# Altium schematic sheet HU_revB.SchDoc
size C; SheetNumber: 1; SheetTotal: 17
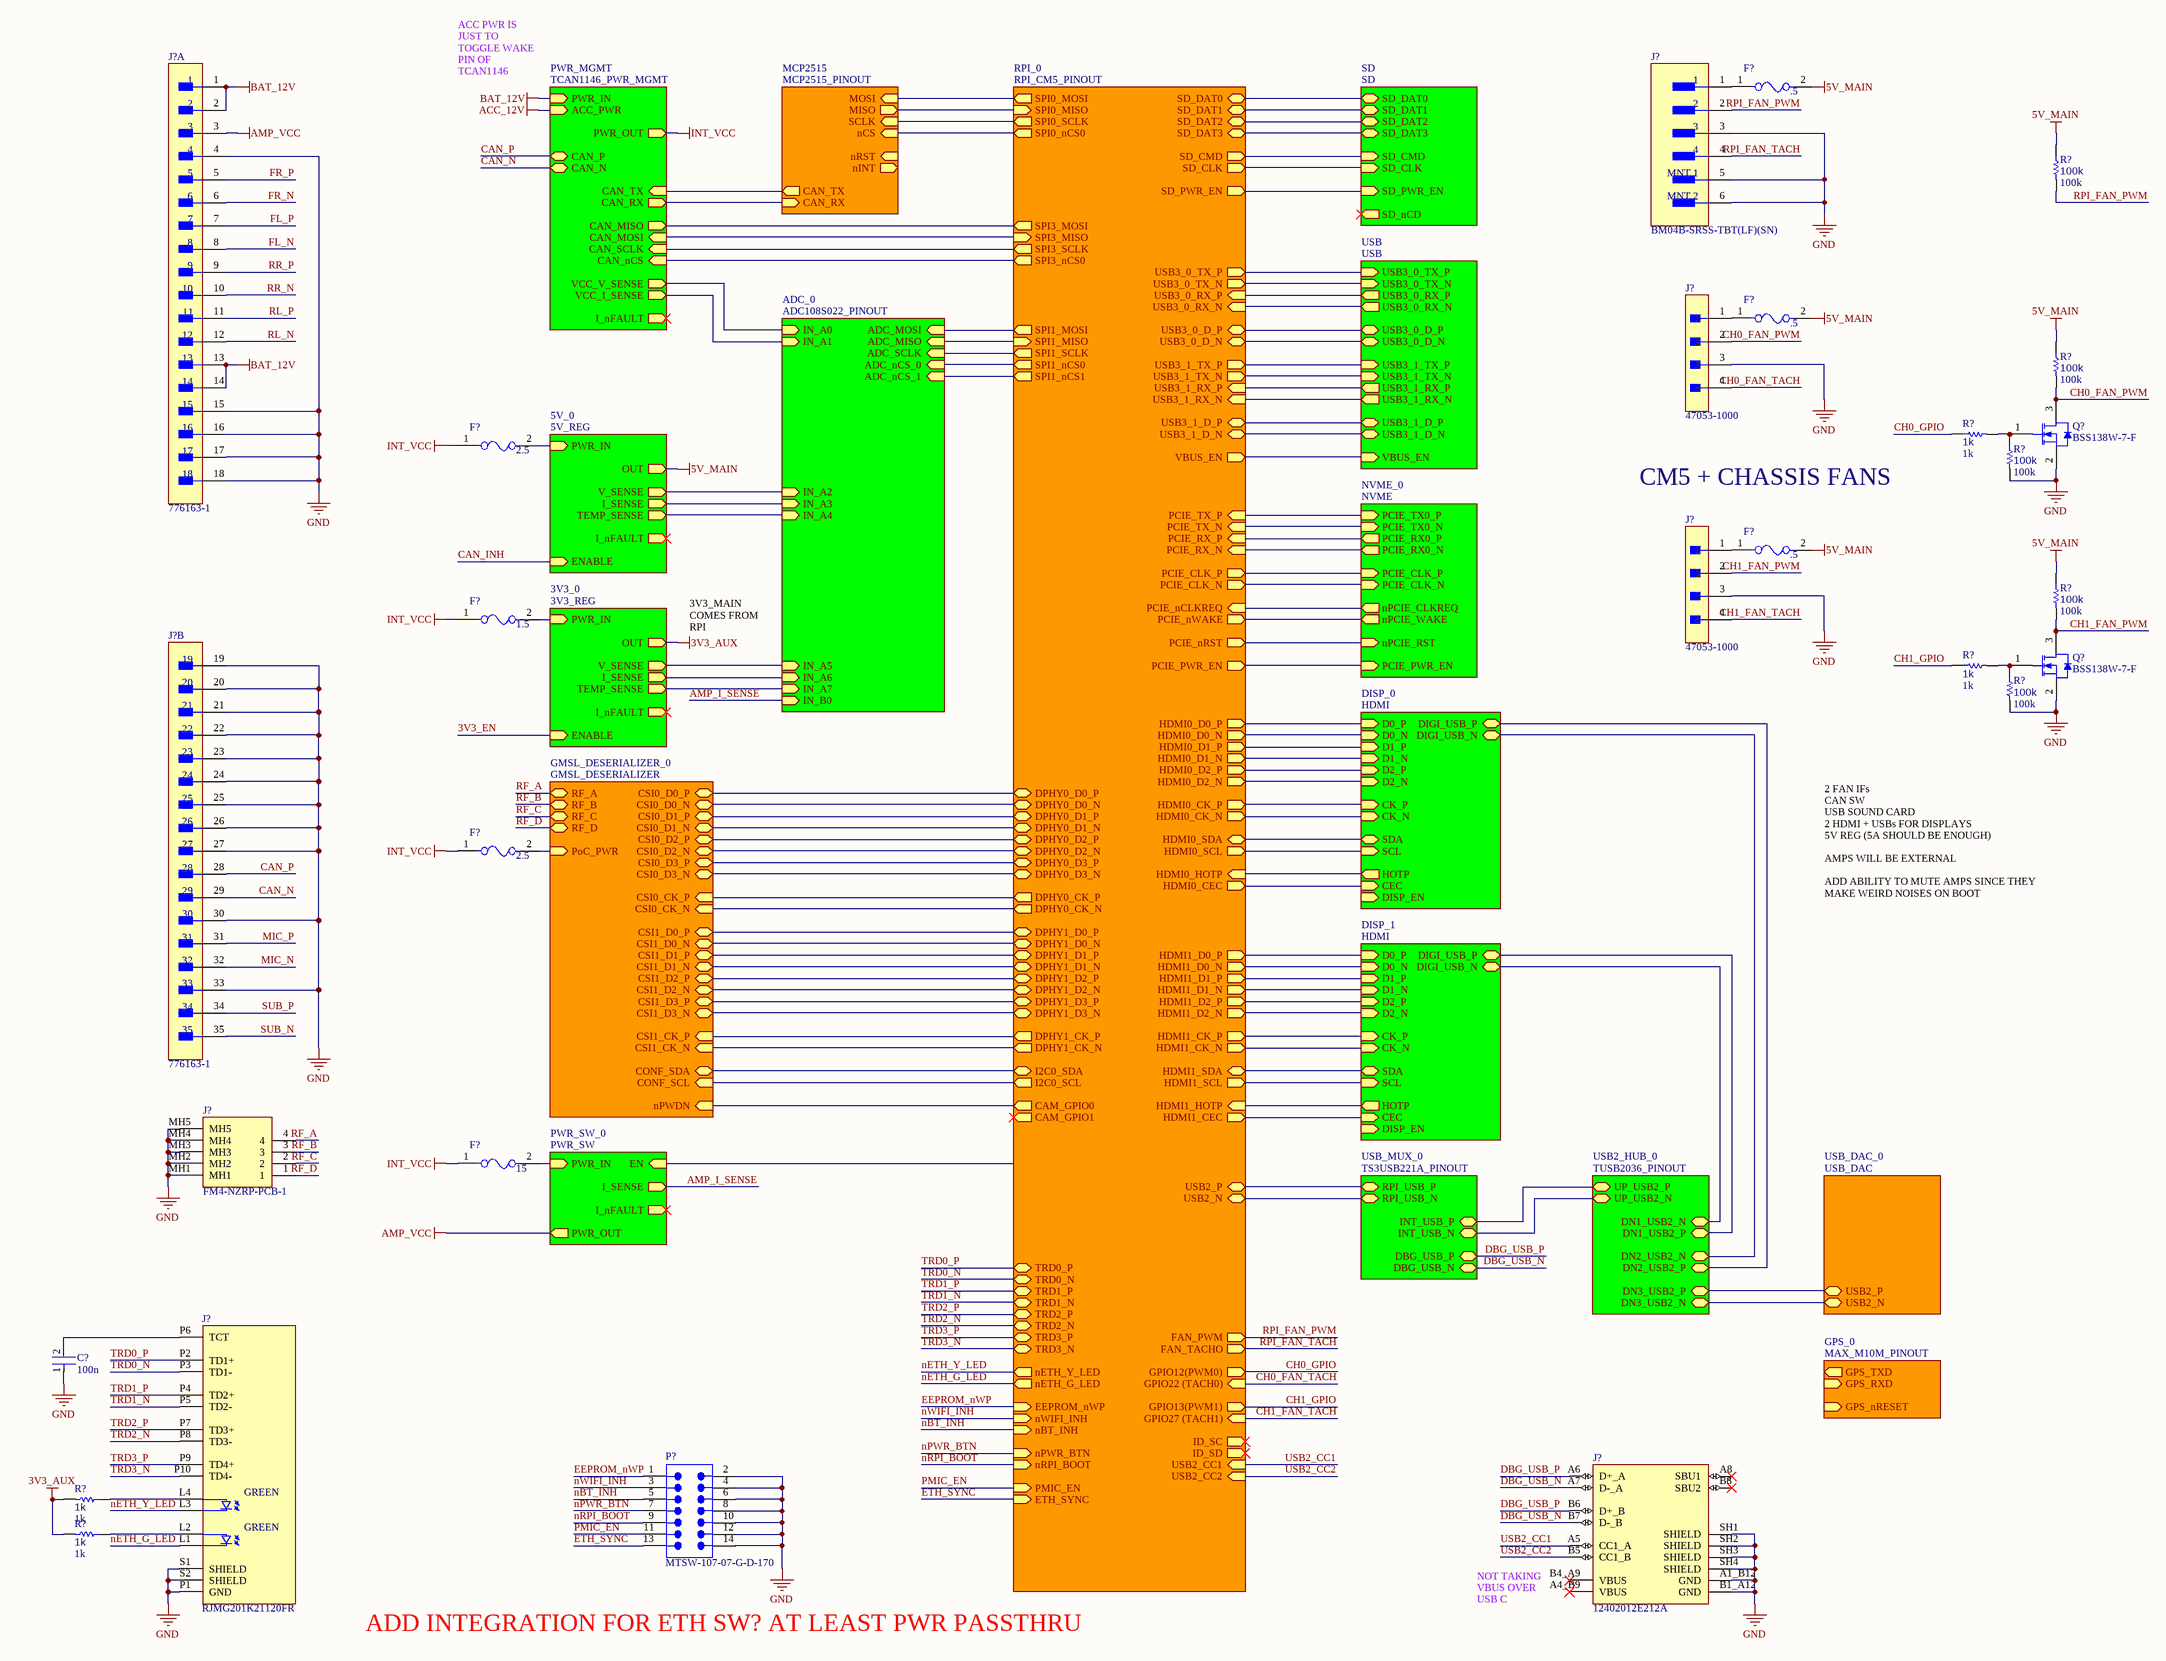
[diagram p0: HU_revB.SchDoc]

## Parts
(Parts that share a designator on the sheet are numbered #1, #2 ... from top to bottom, then left to right.)
C?  100n  [FP-0402-L_1_0_0_05-W_0_5-IPC_A]
F?#1  .5  [FP-0685T-MFG]
F?#2  .5  [FP-0685T-MFG]
F?#3  2.5  [FP-0685T-MFG]
F?#4  .5  [FP-0685T-MFG]
F?#5  1.5  [FP-0685T-MFG]
F?#6  2.5  [FP-0685T-MFG]
F?#7  15  [FP-0685T-MFG]
J?#1  776163-1  [FP-776163-1-MFG]  (part A of 2)
J?#2  BM04B-SRSS-TBT(LF)(SN)  [FP-BM04B-SRSS-TBT_LF_SN-MFG]
J?#3  47053-1000  [FP-470531000-MFG]
J?#4  47053-1000  [FP-470531000-MFG]
J?#5  776163-1  [FP-776163-1-MFG]  (part B of 2)
J?#6  FM4-NZRP-PCB-1  [FM4-NZRP-PCB-1-Footprint-1]
J?#7  RJMG201K21120FR  [RJMG201K21120FR-Footprint-1]
J?#8  12402012E212A  [12402012E212A-Footprint-1]
P?  MTSW-107-07-G-D-170  [SMTC-MTSW-107-07-X-D-170]
Q?#1  BSS138W-7-F  [DIOD-SOT323-3_V]
Q?#2  BSS138W-7-F  [DIOD-SOT323-3_V]
R?#1  100k  [R0603B]
R?#2  100k  [R0603B]
R?#3  1k  [R0603B]
R?#4  100k  [R0603B]
R?#5  100k  [R0603B]
R?#6  1k  [R0603B]
R?#7  100k  [R0603B]
R?#8  1k  [R0603B]
R?#9  1k  [R0603B]

## Sub-sheets
3V3_0 = 3V3_REG: PWR_IN (in), OUT (out), V_SENSE (out), I_SENSE (out), TEMP_SENSE (out), I_nFAULT (out), ENABLE (in)
5V_0 = 5V_REG: PWR_IN (in), OUT (out), V_SENSE (out), I_SENSE (out), TEMP_SENSE (out), I_nFAULT (out), ENABLE (in)
ADC_0 = ADC108S022_PINOUT: IN_A0 (in), IN_A1 (in), IN_A2 (in), IN_A3 (in), IN_A4 (in), IN_A5 (in), IN_A6 (in), IN_A7 (in), IN_B0 (in), ADC_MOSI (in), ADC_MISO (in), ADC_SCLK (in), ADC_nCS_0 (in), ADC_nCS_1 (in)
DISP_0 = HDMI: D0_N (in), D0_P (in), D2_P (in), D2_N (in), D1_P (in), D1_N (in), CK_P (in), CK_N (in), CEC (in), HOTP (out), SCL (in), SDA (bidir), DISP_EN (in), DIGI_USB_P (bidir), DIGI_USB_N (bidir)
DISP_1 = HDMI: D0_N (in), D0_P (in), D2_P (in), D2_N (in), D1_P (in), D1_N (in), CK_P (in), CK_N (in), CEC (in), HOTP (out), SCL (in), SDA (bidir), DISP_EN (in), DIGI_USB_P (bidir), DIGI_USB_N (bidir)
GMSL_DESERIALIZER_0 = GMSL_DESERIALIZER: CSI0_D0_P (bidir), CSI0_D0_N (bidir), CSI0_D1_P (bidir), CSI0_D1_N (bidir), CSI0_D2_P (bidir), CSI0_D2_N (bidir), CSI0_D3_P (bidir), CSI0_D3_N (bidir), CSI0_CK_P (in), CSI0_CK_N (in), CSI1_D0_P (bidir), CSI1_D0_N (bidir), CSI1_D1_P (bidir), CSI1_D1_N (bidir), CSI1_D2_P (bidir), CSI1_D2_N (bidir), CSI1_D3_P (bidir), CSI1_D3_N (bidir), CSI1_CK_P (in), CSI1_CK_N (in), RF_B (bidir), RF_A (bidir), RF_C (bidir), RF_D (bidir), CONF_SDA (bidir), CONF_SCL (in), nPWDN (in), PoC_PWR (in)
GPS_0 = MAX_M10M_PINOUT: GPS_TXD (out), GPS_RXD (in), GPS_nRESET (in)
MCP2515 = MCP2515_PINOUT: MOSI (in), nCS (in), SCLK (in), MISO (out), nINT (out), nRST (in), CAN_RX (in), CAN_TX (out)
NVME_0 = NVME: nPCIE_RST (in), nPCIE_CLKREQ (out), nPCIE_WAKE (out), PCIE_PWR_EN (in), PCIE_TX0_N (in), PCIE_TX0_P (in), PCIE_RX0_N (out), PCIE_RX0_P (out), PCIE_CLK_N (in), PCIE_CLK_P (in)
PWR_MGMT = TCAN1146_PWR_MGMT: PWR_IN (in), PWR_OUT (out), CAN_P (bidir), CAN_N (bidir), CAN_TX (in), CAN_RX (out), CAN_SCLK (in), CAN_MISO (out), CAN_MOSI (in), CAN_nCS (in), VCC_V_SENSE (out), VCC_I_SENSE (out), I_nFAULT (out), ACC_PWR (in)
PWR_SW_0 = PWR_SW: PWR_IN (in), PWR_OUT (out), EN (in), I_SENSE (out), I_nFAULT (out)
RPI_0 = RPI_CM5_PINOUT: SD_CLK (out), SD_CMD (out), SD_DAT3 (bidir), SD_DAT0 (bidir), SD_DAT1 (bidir), SD_DAT2 (bidir), SD_PWR_EN (out), USB3_0_D_P (bidir), USB3_0_D_N (bidir), USB3_1_D_P (bidir), USB3_1_D_N (bidir), USB3_0_RX_N (in), USB3_0_RX_P (in), USB3_0_TX_N (out), USB3_0_TX_P (out), USB3_1_RX_N (in), USB3_1_RX_P (in), USB3_1_TX_N (out), USB3_1_TX_P (out), VBUS_EN (out), PCIE_nCLKREQ (in), PCIE_nWAKE (out), PCIE_PWR_EN (out), PCIE_CLK_P (out), PCIE_nRST (out), PCIE_CLK_N (out), PCIE_RX_P (in), PCIE_RX_N (in), PCIE_TX_P (in), PCIE_TX_N (in), HDMI1_HOTP (in), HDMI1_SDA (bidir), HDMI1_D2_P (out), HDMI1_D2_N (out), HDMI1_SCL (out), HDMI1_CEC (out), HDMI0_CEC (out), HDMI1_D1_P (out), HDMI1_D1_N (out), HDMI0_HOTP (in), HDMI1_D0_P (out), HDMI1_D0_N (out), HDMI1_CK_P (out), HDMI1_CK_N (out), HDMI0_D2_P (out), HDMI0_D2_N (out), HDMI0_D1_P (out), HDMI0_D1_N (out), HDMI0_D0_P (out), HDMI0_D0_N (out), HDMI0_CK_P (out), HDMI0_CK_N (out), HDMI0_SCL (out), HDMI0_SDA (bidir), USB2_N (bidir), USB2_P (bidir), DPHY0_D0_N (bidir), DPHY0_D0_P (bidir), DPHY0_D1_N (bidir), DPHY0_D1_P (bidir), DPHY0_D2_N (bidir), DPHY0_D2_P (bidir), DPHY0_D3_N (bidir), DPHY0_D3_P (bidir), DPHY0_CK_N (out), DPHY0_CK_P (out), DPHY1_D0_N (bidir), DPHY1_D0_P (bidir), DPHY1_D1_N (bidir), DPHY1_D1_P (bidir), DPHY1_D3_N (bidir), DPHY1_D2_N (bidir), DPHY1_D3_P (bidir), DPHY1_D2_P (bidir), DPHY1_CK_N (out), DPHY1_CK_P (out), TRD3_P (bidir), TRD1_P (bidir), TRD3_N (bidir), TRD1_N (bidir), TRD2_N (bidir), TRD0_N (bidir), TRD2_P (bidir), TRD0_P (bidir), nETH_Y_LED (out), nETH_G_LED (out), FAN_TACHO (out), FAN_PWM (out), SPI0_SCLK (out), SPI0_MISO (in), SPI0_nCS0 (out), SPI0_MOSI (out), SPI3_MOSI (out), SPI3_MISO (in), SPI3_SCLK (out), SPI3_nCS0 (out), SPI1_MISO (in), SPI1_MOSI (out), SPI1_nCS0 (out), SPI1_nCS1 (out), SPI1_SCLK (out), I2C0_SCL (out), I2C0_SDA (bidir), CAM_GPIO0 (out), CAM_GPIO1 (out), ETH_SYNC (in), EEPROM_nWP (in), nWIFI_INH (in), nBT_INH (in), nPWR_BTN (in), nRPI_BOOT (in), PMIC_EN (in), GPIO12(PWM0) (out), GPIO13(PWM1) (out), GPIO22 (TACH0) (in), GPIO27 (TACH1) (in), ID_SC (out), ID_SD (out), USB2_CC1 (in), USB2_CC2 (in)
SD = SD: SD_DAT0 (bidir), SD_DAT1 (bidir), SD_DAT2 (bidir), SD_DAT3 (bidir), SD_CMD (in), SD_CLK (in), SD_PWR_EN (in), SD_nCD (out)
USB = USB: USB3_0_D_P (bidir), USB3_0_D_N (bidir), USB3_1_D_P (bidir), USB3_1_D_N (bidir), VBUS_EN (in), USB3_0_TX_N (in), USB3_0_TX_P (in), USB3_0_RX_N (out), USB3_0_RX_P (out), USB3_1_TX_N (in), USB3_1_TX_P (in), USB3_1_RX_N (out), USB3_1_RX_P (out)
USB2_HUB_0 = TUSB2036_PINOUT: UP_USB2_N (bidir), UP_USB2_P (bidir), DN1_USB2_N (bidir), DN1_USB2_P (bidir), DN2_USB2_N (bidir), DN2_USB2_P (bidir), DN3_USB2_N (bidir), DN3_USB2_P (bidir)
USB_DAC_0 = USB_DAC: USB2_P (bidir), USB2_N (bidir)
USB_MUX_0 = TS3USB221A_PINOUT: RPI_USB_P (bidir), RPI_USB_N (bidir), DBG_USB_P (bidir), DBG_USB_N (bidir), INT_USB_P (bidir), INT_USB_N (bidir)

## Nets
3V3_AUX: R?#8.2 R?#9.2 ; sheet 3V3_0/OUT
5V_MAIN: F?#1.2 F?#2.2 F?#4.2 R?#1.1 R?#2.1 R?#5.1 ; sheet 5V_0/OUT
ACC_12V: sheet PWR_MGMT/ACC_PWR
AMP_VCC: J?#1.3 ; sheet PWR_SW_0/PWR_OUT
BAT_12V: J?#1.1 J?#1.2 J?#1.13 J?#1.14 ; sheet PWR_MGMT/PWR_IN
GND: C?.1 J?#1.4 J?#1.15 J?#1.16 J?#1.17 J?#1.18 J?#2.3 J?#2.5(MNT_1) J?#2.6(MNT_2) J?#3.3 J?#4.3 J?#5.19 J?#5.20 J?#5.21 J?#5.22 J?#5.23 J?#5.24 J?#5.25 J?#5.26 J?#5.27 J?#5.30 J?#5.33 J?#6.MH1 J?#6.MH2 J?#6.MH3 J?#6.MH4 J?#6.MH5 J?#7.P1(GND) J?#7.S1(SHIELD) J?#7.S2(SHIELD) J?#8.A1_B12(GND) J?#8.B1_A12(GND) J?#8.SH1(SHIELD) J?#8.SH2(SHIELD) J?#8.SH3(SHIELD) J?#8.SH4(SHIELD) P?.2 P?.4 P?.6 P?.8 P?.10 P?.12 P?.14 Q?#1.2(S) Q?#2.2(S) R?#4.2 R?#7.2
INT_VCC: F?#3.1 F?#5.1 F?#6.1 F?#7.1 ; sheet PWR_MGMT/PWR_OUT
3V3_EN: sheet 3V3_0/ENABLE
AMP_I_SENSE: sheet ADC_0/IN_B0, sheet PWR_SW_0/I_SENSE
CAN_INH: sheet 5V_0/ENABLE
CAN_N: J?#5.29 ; sheet PWR_MGMT/CAN_N
CAN_P: J?#5.28 ; sheet PWR_MGMT/CAN_P
CH0_FAN_PWM: J?#3.2 Q?#1.3(D) R?#2.2
CH0_FAN_TACH: J?#3.4 ; sheet RPI_0/GPIO22 (TACH0)
CH0_GPIO: R?#3.1 ; sheet RPI_0/GPIO12(PWM0)
CH1_FAN_PWM: J?#4.2 Q?#2.3(D) R?#5.2
CH1_FAN_TACH: J?#4.4 ; sheet RPI_0/GPIO27 (TACH1)
CH1_GPIO: R?#6.1 ; sheet RPI_0/GPIO13(PWM1)
DBG_USB_N: J?#8.A7(D-_A) J?#8.B7(D-_B) ; sheet USB_MUX_0/DBG_USB_N
DBG_USB_P: J?#8.A6(D+_A) J?#8.B6(D+_B) ; sheet USB_MUX_0/DBG_USB_P
EEPROM_nWP: P?.1 ; sheet RPI_0/EEPROM_nWP
ETH_SYNC: P?.13 ; sheet RPI_0/ETH_SYNC
FL_N: J?#1.8
FL_P: J?#1.7
FR_N: J?#1.6
FR_P: J?#1.5
MIC_N: J?#5.32
MIC_P: J?#5.31
nBT_INH: P?.5 ; sheet RPI_0/nBT_INH
nETH_G_LED: J?#7.L1 ; sheet RPI_0/nETH_G_LED
nETH_Y_LED: J?#7.L3 ; sheet RPI_0/nETH_Y_LED
nPWR_BTN: P?.7 ; sheet RPI_0/nPWR_BTN
nRPI_BOOT: P?.9 ; sheet RPI_0/nRPI_BOOT
nWIFI_INH: P?.3 ; sheet RPI_0/nWIFI_INH
PMIC_EN: P?.11 ; sheet RPI_0/PMIC_EN
RF_A: J?#6.4 ; sheet GMSL_DESERIALIZER_0/RF_A
RF_B: J?#6.3 ; sheet GMSL_DESERIALIZER_0/RF_B
RF_C: J?#6.2 ; sheet GMSL_DESERIALIZER_0/RF_C
RF_D: J?#6.1 ; sheet GMSL_DESERIALIZER_0/RF_D
RL_N: J?#1.12
RL_P: J?#1.11
RPI_FAN_PWM: J?#2.2 R?#1.2 ; sheet RPI_0/FAN_PWM
RPI_FAN_TACH: J?#2.4 ; sheet RPI_0/FAN_TACHO
RR_N: J?#1.10
RR_P: J?#1.9
SUB_N: J?#5.35
SUB_P: J?#5.34
TRD0_N: J?#7.P3(TD1-) ; sheet RPI_0/TRD0_N
TRD0_P: J?#7.P2(TD1+) ; sheet RPI_0/TRD0_P
TRD1_N: J?#7.P5(TD2-) ; sheet RPI_0/TRD1_N
TRD1_P: J?#7.P4(TD2+) ; sheet RPI_0/TRD1_P
TRD2_N: J?#7.P8(TD3-) ; sheet RPI_0/TRD2_N
TRD2_P: J?#7.P7(TD3+) ; sheet RPI_0/TRD2_P
TRD3_N: J?#7.P10(TD4-) ; sheet RPI_0/TRD3_N
TRD3_P: J?#7.P9(TD4+) ; sheet RPI_0/TRD3_P
USB2_CC1: J?#8.A5(CC1_A) ; sheet RPI_0/USB2_CC1
USB2_CC2: J?#8.B5(CC1_B) ; sheet RPI_0/USB2_CC2
NetC?_2: C?.2 J?#7.P6(TCT)
NetF?#1_1: F?#1.1 J?#2.1
NetF?#2_1: F?#2.1 J?#3.1
NetF?#3_2: F?#3.2 ; sheet 5V_0/PWR_IN
NetF?#4_1: F?#4.1 J?#4.1
NetF?#5_2: F?#5.2 ; sheet 3V3_0/PWR_IN
NetF?#6_2: F?#6.2 ; sheet GMSL_DESERIALIZER_0/PoC_PWR
NetF?#7_2: F?#7.2 ; sheet PWR_SW_0/PWR_IN
NetJ?#7_L2: J?#7.L2 R?#9.1
NetJ?#7_L4: J?#7.L4 R?#8.1
NetQ?#1_1: Q?#1.1(G) R?#3.2 R?#4.1
NetQ?#2_1: Q?#2.1(G) R?#6.2 R?#7.1
(unnamed): sheet PWR_MGMT/CAN_TX, sheet MCP2515/CAN_TX
(unnamed): sheet PWR_MGMT/CAN_RX, sheet MCP2515/CAN_RX
(unnamed): sheet PWR_MGMT/CAN_SCLK, sheet RPI_0/SPI3_SCLK
(unnamed): sheet PWR_MGMT/CAN_MISO, sheet RPI_0/SPI3_MOSI
(unnamed): sheet PWR_MGMT/CAN_MOSI, sheet RPI_0/SPI3_MISO
(unnamed): sheet PWR_MGMT/CAN_nCS, sheet RPI_0/SPI3_nCS0
(unnamed): sheet PWR_MGMT/VCC_V_SENSE, sheet ADC_0/IN_A0
(unnamed): sheet PWR_MGMT/VCC_I_SENSE, sheet ADC_0/IN_A1
(unnamed): sheet USB_DAC_0/USB2_P, sheet USB2_HUB_0/DN3_USB2_P
(unnamed): sheet USB_DAC_0/USB2_N, sheet USB2_HUB_0/DN3_USB2_N
(unnamed): sheet RPI_0/SD_CLK, sheet SD/SD_CLK
(unnamed): sheet RPI_0/SD_CMD, sheet SD/SD_CMD
(unnamed): sheet RPI_0/SD_DAT3, sheet SD/SD_DAT3
(unnamed): sheet RPI_0/SD_DAT0, sheet SD/SD_DAT0
(unnamed): sheet RPI_0/SD_DAT1, sheet SD/SD_DAT1
(unnamed): sheet RPI_0/SD_DAT2, sheet SD/SD_DAT2
(unnamed): sheet RPI_0/SD_PWR_EN, sheet SD/SD_PWR_EN
(unnamed): sheet RPI_0/USB3_0_D_P, sheet USB/USB3_0_D_P
(unnamed): sheet RPI_0/USB3_0_D_N, sheet USB/USB3_0_D_N
(unnamed): sheet RPI_0/USB3_1_D_P, sheet USB/USB3_1_D_P
(unnamed): sheet RPI_0/USB3_1_D_N, sheet USB/USB3_1_D_N
(unnamed): sheet RPI_0/USB3_0_RX_N, sheet USB/USB3_0_RX_N
(unnamed): sheet RPI_0/USB3_0_RX_P, sheet USB/USB3_0_RX_P
(unnamed): sheet RPI_0/USB3_0_TX_N, sheet USB/USB3_0_TX_N
(unnamed): sheet RPI_0/USB3_0_TX_P, sheet USB/USB3_0_TX_P
(unnamed): sheet RPI_0/USB3_1_RX_N, sheet USB/USB3_1_RX_N
(unnamed): sheet RPI_0/USB3_1_RX_P, sheet USB/USB3_1_RX_P
(unnamed): sheet RPI_0/USB3_1_TX_N, sheet USB/USB3_1_TX_N
(unnamed): sheet RPI_0/USB3_1_TX_P, sheet USB/USB3_1_TX_P
(unnamed): sheet RPI_0/VBUS_EN, sheet USB/VBUS_EN
(unnamed): sheet RPI_0/PCIE_nCLKREQ, sheet NVME_0/nPCIE_CLKREQ
(unnamed): sheet RPI_0/PCIE_nWAKE, sheet NVME_0/nPCIE_WAKE
(unnamed): sheet RPI_0/PCIE_PWR_EN, sheet NVME_0/PCIE_PWR_EN
(unnamed): sheet RPI_0/PCIE_CLK_P, sheet NVME_0/PCIE_CLK_P
(unnamed): sheet RPI_0/PCIE_nRST, sheet NVME_0/nPCIE_RST
(unnamed): sheet RPI_0/PCIE_CLK_N, sheet NVME_0/PCIE_CLK_N
(unnamed): sheet RPI_0/PCIE_RX_P, sheet NVME_0/PCIE_RX0_P
(unnamed): sheet RPI_0/PCIE_RX_N, sheet NVME_0/PCIE_RX0_N
(unnamed): sheet RPI_0/PCIE_TX_P, sheet NVME_0/PCIE_TX0_P
(unnamed): sheet RPI_0/PCIE_TX_N, sheet NVME_0/PCIE_TX0_N
(unnamed): sheet RPI_0/HDMI1_HOTP, sheet DISP_1/HOTP
(unnamed): sheet RPI_0/HDMI1_SDA, sheet DISP_1/SDA
(unnamed): sheet RPI_0/HDMI1_D2_P, sheet DISP_1/D2_P
(unnamed): sheet RPI_0/HDMI1_D2_N, sheet DISP_1/D2_N
(unnamed): sheet RPI_0/HDMI1_SCL, sheet DISP_1/SCL
(unnamed): sheet RPI_0/HDMI1_CEC, sheet DISP_1/CEC
(unnamed): sheet RPI_0/HDMI0_CEC, sheet DISP_0/CEC
(unnamed): sheet RPI_0/HDMI1_D1_P, sheet DISP_1/D1_P
(unnamed): sheet RPI_0/HDMI1_D1_N, sheet DISP_1/D1_N
(unnamed): sheet RPI_0/HDMI0_HOTP, sheet DISP_0/HOTP
(unnamed): sheet RPI_0/HDMI1_D0_P, sheet DISP_1/D0_P
(unnamed): sheet RPI_0/HDMI1_D0_N, sheet DISP_1/D0_N
(unnamed): sheet RPI_0/HDMI1_CK_P, sheet DISP_1/CK_P
(unnamed): sheet RPI_0/HDMI1_CK_N, sheet DISP_1/CK_N
(unnamed): sheet RPI_0/HDMI0_D2_P, sheet DISP_0/D2_P
(unnamed): sheet RPI_0/HDMI0_D2_N, sheet DISP_0/D2_N
(unnamed): sheet RPI_0/HDMI0_D1_P, sheet DISP_0/D1_P
(unnamed): sheet RPI_0/HDMI0_D1_N, sheet DISP_0/D1_N
(unnamed): sheet RPI_0/HDMI0_D0_P, sheet DISP_0/D0_P
(unnamed): sheet RPI_0/HDMI0_D0_N, sheet DISP_0/D0_N
(unnamed): sheet RPI_0/HDMI0_CK_P, sheet DISP_0/CK_P
(unnamed): sheet RPI_0/HDMI0_CK_N, sheet DISP_0/CK_N
(unnamed): sheet RPI_0/HDMI0_SCL, sheet DISP_0/SCL
(unnamed): sheet RPI_0/HDMI0_SDA, sheet DISP_0/SDA
(unnamed): sheet RPI_0/USB2_N, sheet USB_MUX_0/RPI_USB_N
(unnamed): sheet RPI_0/USB2_P, sheet USB_MUX_0/RPI_USB_P
(unnamed): sheet RPI_0/DPHY0_D0_N, sheet GMSL_DESERIALIZER_0/CSI0_D0_N
(unnamed): sheet RPI_0/DPHY0_D0_P, sheet GMSL_DESERIALIZER_0/CSI0_D0_P
(unnamed): sheet RPI_0/DPHY0_D1_N, sheet GMSL_DESERIALIZER_0/CSI0_D1_N
(unnamed): sheet RPI_0/DPHY0_D1_P, sheet GMSL_DESERIALIZER_0/CSI0_D1_P
(unnamed): sheet RPI_0/DPHY0_D2_N, sheet GMSL_DESERIALIZER_0/CSI0_D2_N
(unnamed): sheet RPI_0/DPHY0_D2_P, sheet GMSL_DESERIALIZER_0/CSI0_D2_P
(unnamed): sheet RPI_0/DPHY0_D3_N, sheet GMSL_DESERIALIZER_0/CSI0_D3_N
(unnamed): sheet RPI_0/DPHY0_D3_P, sheet GMSL_DESERIALIZER_0/CSI0_D3_P
(unnamed): sheet RPI_0/DPHY0_CK_N, sheet GMSL_DESERIALIZER_0/CSI0_CK_N
(unnamed): sheet RPI_0/DPHY0_CK_P, sheet GMSL_DESERIALIZER_0/CSI0_CK_P
(unnamed): sheet RPI_0/DPHY1_D0_N, sheet GMSL_DESERIALIZER_0/CSI1_D0_N
(unnamed): sheet RPI_0/DPHY1_D0_P, sheet GMSL_DESERIALIZER_0/CSI1_D0_P
(unnamed): sheet RPI_0/DPHY1_D1_N, sheet GMSL_DESERIALIZER_0/CSI1_D1_N
(unnamed): sheet RPI_0/DPHY1_D1_P, sheet GMSL_DESERIALIZER_0/CSI1_D1_P
(unnamed): sheet RPI_0/DPHY1_D3_N, sheet GMSL_DESERIALIZER_0/CSI1_D3_N
(unnamed): sheet RPI_0/DPHY1_D2_N, sheet GMSL_DESERIALIZER_0/CSI1_D2_N
(unnamed): sheet RPI_0/DPHY1_D3_P, sheet GMSL_DESERIALIZER_0/CSI1_D3_P
(unnamed): sheet RPI_0/DPHY1_D2_P, sheet GMSL_DESERIALIZER_0/CSI1_D2_P
(unnamed): sheet RPI_0/DPHY1_CK_N, sheet GMSL_DESERIALIZER_0/CSI1_CK_N
(unnamed): sheet RPI_0/DPHY1_CK_P, sheet GMSL_DESERIALIZER_0/CSI1_CK_P
(unnamed): sheet RPI_0/SPI0_SCLK, sheet MCP2515/SCLK
(unnamed): sheet RPI_0/SPI0_MISO, sheet MCP2515/MISO
(unnamed): sheet RPI_0/SPI0_nCS0, sheet MCP2515/nCS
(unnamed): sheet RPI_0/SPI0_MOSI, sheet MCP2515/MOSI
(unnamed): sheet RPI_0/SPI1_MISO, sheet ADC_0/ADC_MISO
(unnamed): sheet RPI_0/SPI1_MOSI, sheet ADC_0/ADC_MOSI
(unnamed): sheet RPI_0/SPI1_nCS0, sheet ADC_0/ADC_nCS_0
(unnamed): sheet RPI_0/SPI1_nCS1, sheet ADC_0/ADC_nCS_1
(unnamed): sheet RPI_0/SPI1_SCLK, sheet ADC_0/ADC_SCLK
(unnamed): sheet RPI_0/I2C0_SCL, sheet GMSL_DESERIALIZER_0/CONF_SCL
(unnamed): sheet RPI_0/I2C0_SDA, sheet GMSL_DESERIALIZER_0/CONF_SDA
(unnamed): sheet RPI_0/CAM_GPIO0, sheet GMSL_DESERIALIZER_0/nPWDN
(unnamed): sheet 5V_0/V_SENSE, sheet ADC_0/IN_A2
(unnamed): sheet 5V_0/I_SENSE, sheet ADC_0/IN_A3
(unnamed): sheet 5V_0/TEMP_SENSE, sheet ADC_0/IN_A4
(unnamed): sheet ADC_0/IN_A5, sheet 3V3_0/V_SENSE
(unnamed): sheet ADC_0/IN_A6, sheet 3V3_0/I_SENSE
(unnamed): sheet ADC_0/IN_A7, sheet 3V3_0/TEMP_SENSE
(unnamed): sheet DISP_0/DIGI_USB_P, sheet USB2_HUB_0/DN2_USB2_P
(unnamed): sheet DISP_0/DIGI_USB_N, sheet USB2_HUB_0/DN2_USB2_N
(unnamed): sheet USB2_HUB_0/UP_USB2_N, sheet USB_MUX_0/INT_USB_N
(unnamed): sheet USB2_HUB_0/UP_USB2_P, sheet USB_MUX_0/INT_USB_P
(unnamed): sheet USB2_HUB_0/DN1_USB2_N, sheet DISP_1/DIGI_USB_N
(unnamed): sheet USB2_HUB_0/DN1_USB2_P, sheet DISP_1/DIGI_USB_P

Not connected (* = marked no-connect by the designer): J?#8 A4_B9(VBUS)* A8(SBU1)* B4_A9(VBUS)* B8(SBU2)*

## Notes on the sheet
- ACC PWR IS JUST TO TOGGLE WAKE PIN OF TCAN1146
- CM5 + CHASSIS FANS
- 3V3_MAIN COMES FROM RPI
- 2 FAN IFs
  CAN SW
  USB SOUND CARD
  2 HDMI + USBs FOR DISPLAYS
  5V REG (5A SHOULD BE ENOUGH)
  AMPS WILL BE EXTERNAL
  ADD ABILITY TO MUTE AMPS SINCE THEY MAKE WEIRD NOISES ON BOOT
- NOT TAKING VBUS OVER USB C
- ADD INTEGRATION FOR ETH SW? AT LEAST PWR PASSTHRU
- (in symbol CMP-002-00090-1) GREEN

## Library data of the parts
C? = CMP-001-00058-1: LARGE PADS, 0402 CAP, CHANGE COMMENT TO MATCH REAL P/N; Capacitor Type: Ceramic; Min Operating Temperature: -55°C; Mounting Technology: Surface Mount; Pins: 2; Case/Package: 0402; RoHS Compliant: Yes; Max Operating Temperature: 85°C
F?#1-F?#7 = CMP-16042-000006-1: FUSE BOARD MNT 5A 63VAC/VDC 1206; RoHS Compliant: Yes
J?#1 J?#5 = CMP-03369-000154-1: CONN HEADER R/A 35POS 4MM; Primary Type: Rectangular; Circuit Application: Power; Tab Thickness: 1.3mm; Number of Signal Positions: 35; Shielding: Unshielded; Pitch: 0.157inch; Max Voltage Rating (AC): 250V; Connector System: Wire-to-Device; Insulation: Insulated; Current Rating: 17A; PCB Thickness: 0.062inch; PCB Mount Retention: With; Gender: Male; Connector Type: Male Pin; PCB Mount Alignment: Yes (With); Series: Ampseal; Depth: 37.9mm; Orientation: Right Angle; Length: 3.03inch; Termination: Solder; Radiation Hardening: No; Number of Rows: 3; Contact Plating: Tin; Lead Free: Lead Free; Flammability Rating: UL94 V-0; Contact Material: Brass; Number of Contacts: 35; ELV: Compliant; Max Operating Temperature: 221°C; Min Operating Temperature: -40°C; Package Quantity: 1; Mount: Through Hole; Contact Type: Male Pin; Housing Material: Thermoplastic; Number of Positions: 35; Packaging: Bulk; Row Spacing: 0.157inch; RoHS Compliant: Yes; Height: 32.1mm; Color: Black; Fastening Type: Ramp; Sealable: Yes (With); Width: 37.9mm
J?#2 = CMP-17439-000370-1: CONN HEADER SMD 4POS 1MM; Voltage Rating: 50V; Number of Positions: 4; Pitch: 0.039inch; Mated Stacking Heights: 4.9mm; Packaging: Cut Tape; Contact Material: Copper Alloy; Lead Free: Lead Free; Contact Type: Male Pin; Fastening Type: Pull; Connector Type: Header; Contact Finish - Mating: TIN; Series: SR; Number of Rows: 1; Contact Shape: Square; Package Quantity: 1; Color: Natural; Flammability Rating: UL94 V-0; Mount: Surface Mount; Insulation Color: Natural; Termination: Solder; Contact Plating: Tin; Insulation Material: Nylon
J?#3 J?#4 = CMP-04776-000290-2: CONN HEADER VERT 4POS 2.54MM; NexarPartId: 854935; Manufacturer Lifecycle Status: ACTIVE; Voltage Rating (DC): 250V; Gender: Male; Plating: Copper; Number of Positions: 4; Glow Wire Compliant: Non-compliant; Current Rating: 500mA; Max Operating Temperature: 75°C; Number of Rows: 1; REACH SVHC: Unknown; Ambient Temperature Range High: 105°C; Pitch: 2.54mm; Height: 7.7mm; Min Operating Temperature: 0°C; Packaging: Bulk; Contact Material: Brass, Copper; Contact Plating: Tin; Lead Pitch: 2.54mm; Voltage Rating: 250V; Termination: Through Hole; Radiation Hardening: No; Orientation: Vertical; Mount: Through Hole; Number of Pins: 4; Country of Origin: HK; Halogen Free: Low Halogen; Lifecycle Status: Production; Number of Circuits: 4; Schedule B: 8536694040, 8536694040; Housing Color: Beige; Housing Material: Nylon; Depth: 5.84mm; RoHS: Compliant; Length: 10.2mm; Number of Contacts: 4
J?#6 = CMP-002-00044-4: Connector RF Mini-FAKRA Plug 9GHz 50Ohm Solder Right Angle Through Hole; Source: fakra4ch.SchLib; Component Type: Standard; Pins: 9; Design Item ID: CMP-002-00085-1
J?#7 = CMP-002-00090-1: Connector RJ45 Receptacle 8 Position Solder Straight Through Hole 1 Port Tray; Pins: 8; Max Operating Temperature: 70°C; Min Operating Temperature: 0°C
J?#8 = CMP-002-00091-1: USB Connector, USB Type C, USB 2.0, Receptacle, 24 Ways, Surface Mount, Through Hole Mount; Pins: 24
P? = CMP-1024-00130-1: Modified .025" SQ Post Header, Through-hole, Vertical, -55 to 125 degC, 2.54 mm Pitch, 14-Pin, Male, RoHS; Manufacturer: Samtec; Pitch: 2.54 mm; ComponentLink3URL: http://www.samtec.com/documents/webfiles/cpdf/MTSW-XXX-XX-X-X-XXXX-XX-XXX-MKT1.pdf; ComponentLink2URL: http://www.samtec.com/documents/webfiles/pdf/MTSW.PDF; PackageVersion: BI, 2/1987; Orientation: Vertical; ComponentLink1URL: http://www.samtec.com; ComponentLink2Description: Datasheet; PackageReference: MTSW-107-07-X-D-170; PartNumber: MTSW-107-07-G-D-170; Temperature Range: -55 to 125 degC; PackageDescription: Assembly .025" [.64] SQ Post Terminal Strip; RoHS: True; ComponentLink3Description: Package Specification; DatasheetVersion: F-214; Mounting Technology: Through-hole; ComponentLink1Description: Manufacturer URL
Q?#1 Q?#2 = CMP-2000-05968-1: N-Channel Enhancement Mode Mosfet, 50 V, 200 mA, -55 to 150 degC, 6-Pin SOT-323, RoHS, Tape and Reel; Typical Turn-Off Delay Time: 20ns; Number of Channels: 1Channel; Type: EnhancementModeFieldEffectTransistor; Brand: DiodesIncorporated; Vds - Drain-Source Breakdown Voltage: 75V; Vgs - Gate-Source Voltage: 20V; Rds On - Drain-Source Resistance: 1.4Ohms; Transistor Type: 1N-Channel; Configuration: Single; Unit Weight: 0.000212oz; Pd - Power Dissipation: 200mW; Id - Continuous Drain Current: 200mA; Forward Transconductance - Min: 0.1S; Manufacturer URL: http://www.diodes.com/; Series: BSS138; Package Description: 3-Pin Small Outline Transistor, Body 2 x 1.25 mm, Pitch 0.65 mm; Mounting Technology: SurfaceMount; Product Category: MOSFET; RoHS: True; Maximum Operating Temperature: +150C; Height: 1mm; Length: 2.2mm; Technology: Si; Width: 1.35mm; Datasheet URL: http://www.diodes.com/_files/datasheets/ds30206.pdf; Manufacturer: DiodesIncorporated; Package / Case: SOT-323-3; Typical Turn-On Delay Time: 20ns; Transistor Polarity: N-Channel; Factory Pack Quantity: 3000; Packaging: Reel; Product: MOSFETSmallSignal; Datasheet Version: Rev. 11-2, 09/2013; Package Reference: SOT323; Minimum Operating Temperature: -55C; Mounting Style: SMD/SMT; Channel Mode: Enhancement
R?#1-R?#9 = CMP-009-00002-14: Resistor
  R?#1 R?#2 R?#4 R?#5 R?#7: Value: 100k
  R?#3 R?#6 R?#8 R?#9: Value: 1k